# Altium schematic sheet Power.SchDoc: QUTMS Shutdown V2 - Power
size A4; Author: Jonn Dillon; Organization: QUT Motorsport; Address1: O-120; Address2: O Block; Address3: QUT Gardens Point; Address4: Brisbane, 4000; DocumentNumber: 9; SheetNumber: 9; SheetTotal: 10
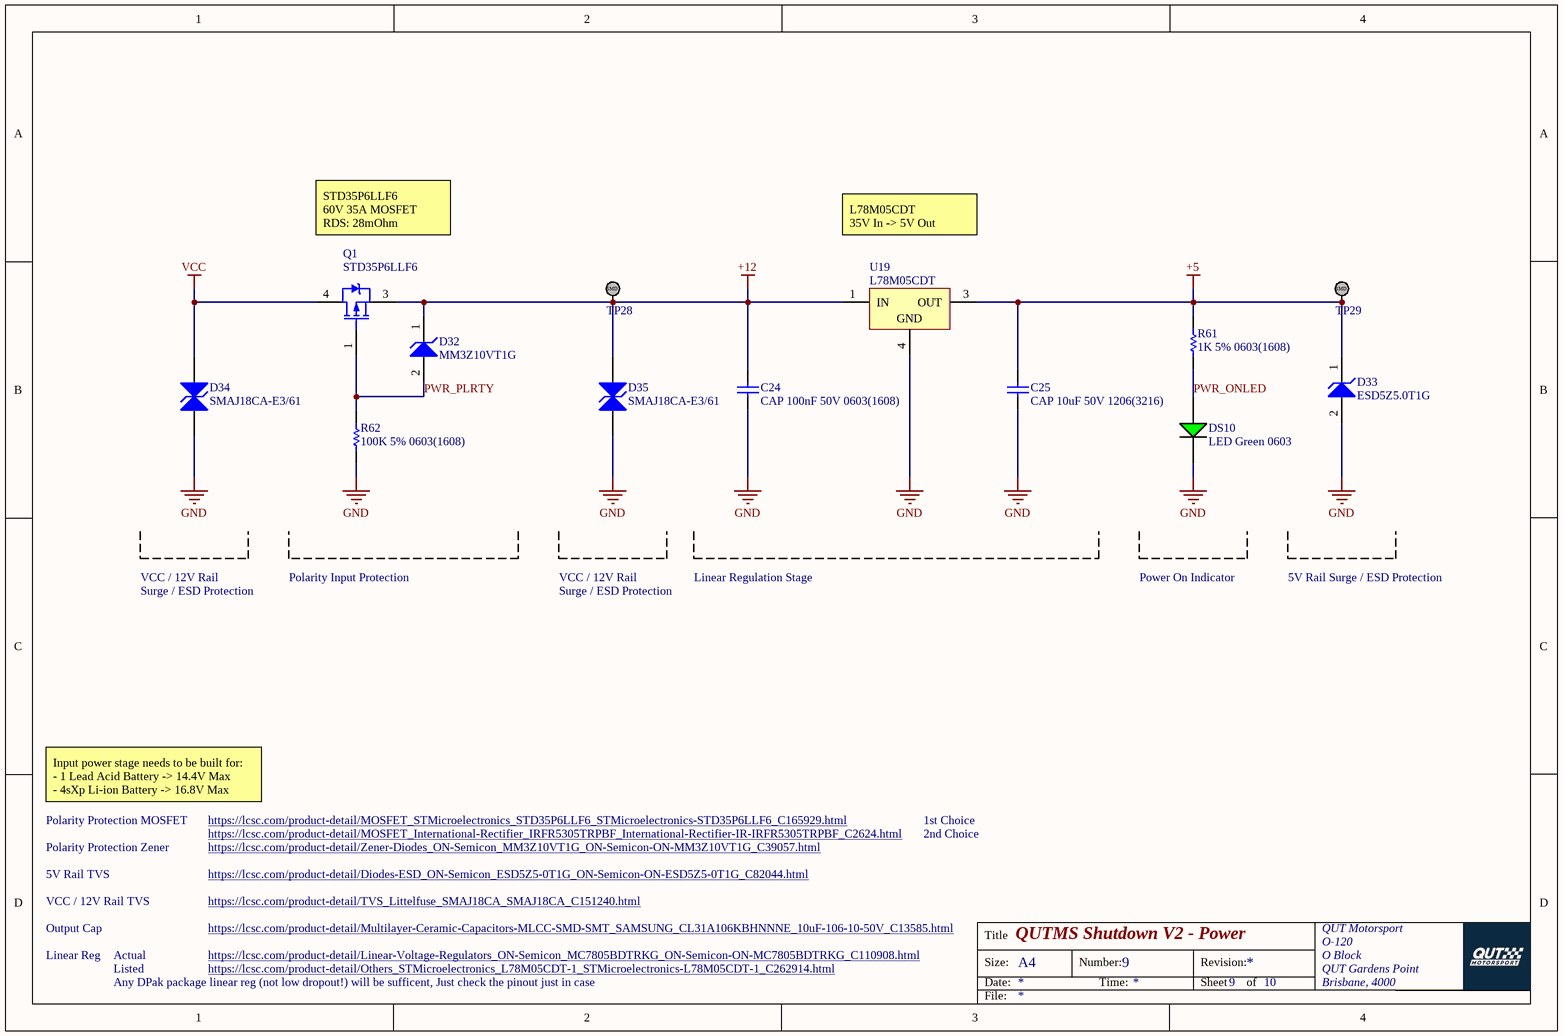
[diagram p0: Power.SchDoc]

## Parts
C24  CAP 100nF 50V 0603(1608)  [CAPC0603(1608)100_N]
C25  CAP 10uF 50V 1206(3216)  [CAPC1206(3216)190_N]
D32  MM3Z10VT1G  [ONSC-SOD-323-2-477-02_V]
D33  ESD5Z5.0T1G  [ONSC-SOD-523-2-502-01_V]
D34  SMAJ18CA-E3/61  [VISH-DO-214AC-2_N]
D35  SMAJ18CA-E3/61  [VISH-DO-214AC-2_N]
DS10  LED Green 0603  [LED GREEN 0603]
Q1  STD35P6LLF6  [ONSC-DPAK-3-369C-01_V]
R61  1K 5% 0603(1608)  [RESC0603(1608)_N]
R62  100K 5% 0603(1608)  [RESC0603(1608)_N]
TP28  TestPoint_SMD  [TestPointSMD]  (value not drawn)
TP29  TestPoint_SMD  [TestPointSMD]  (value not drawn)
U19  L78M05CDT  [STM-TO252-3_A_V]

## Nets
+5: C25.2 D33.1(K) R61.2 TP29.1 U19.3(OUT)
+12: C24.2 D32.1(K) D35.2(A2) Q1.3(S) TP28.1 U19.1(IN)
GND: C24.1 C25.1 D33.2(A) D34.1(A1) D35.1(A1) DS10.2(C) R62.1 U19.4(GND)
VCC: D34.2(A2) Q1.4(D)
PWR_ONLED: DS10.1(A) R61.1
PWR_PLRTY: D32.2(A) Q1.1(G) R62.2

## Notes on the sheet
- STD35P6LLF6
  60V 35A MOSFET
  RDS: 28mOhm
- L78M05CDT
  35V In -> 5V Out
- VCC / 12V Rail
- Polarity Input Protection
- Linear Regulation Stage
- Power On Indicator
- 5V Rail Surge / ESD Protection
- Surge / ESD Protection
- Polarity Protection MOSFET
- Polarity Protection Zener
- Input power stage needs to be built for:
  - 1 Lead Acid Battery -> 14.4V Max
  - 4sXp Li-ion Battery -> 16.8V Max
- https://lcsc.com/product-detail/MOSFET_International-Rectifier_IRFR5305TRPBF_International-Rectifier-IR-IRFR5305TRPBF_C2624.html
- https://lcsc.com/product-detail/Zener-Diodes_ON-Semicon_MM3Z10VT1G_ON-Semicon-ON-MM3Z10VT1G_C39057.html
- https://lcsc.com/product-detail/MOSFET_STMicroelectronics_STD35P6LLF6_STMicroelectronics-STD35P6LLF6_C165929.html
- 1st Choice
- 2nd Choice
- 5V Rail TVS
- VCC / 12V Rail TVS
- https://lcsc.com/product-detail/Diodes-ESD_ON-Semicon_ESD5Z5-0T1G_ON-Semicon-ON-ESD5Z5-0T1G_C82044.html
- https://lcsc.com/product-detail/TVS_Littelfuse_SMAJ18CA_SMAJ18CA_C151240.html
- Linear Reg
- Output Cap
- Actual
- Listed
- Any DPak package linear reg (not low dropout!) will be sufficent, Just check the pinout just in case
- https://lcsc.com/product-detail/Multilayer-Ceramic-Capacitors-MLCC-SMD-SMT_SAMSUNG_CL31A106KBHNNNE_10uF-106-10-50V_C13585.html
- https://lcsc.com/product-detail/Linear-Voltage-Regulators_ON-Semicon_MC7805BDTRKG_ON-Semicon-ON-MC7805BDTRKG_C110908.html
- https://lcsc.com/product-detail/Others_STMicroelectronics_L78M05CDT-1_STMicroelectronics-L78M05CDT-1_C262914.html
- Title
- Size:
- Date:
- A4
- Number:
- Time:
- Revision:
- Sheet
- of
- File:
- (in symbol TestPoint_SMD) SMD

## Library data of the parts
C24 = CMP-1035-02591-1: CAP 100nF 50V ±5% 0603 (1608 Metric) Thickness 1mm SMD; Tolerance: Â±5%; Case-Metric: 1608; Case-EIA: 0603; Rated Voltage: 50 V; Max Thickness: 1 mm; Technology: SMT; Value: 100nF
C25 = CMP-1037-04982-1: CAP 10uF 50V ±10% 1206 (3216 Metric) Thickness 1.9mm SMD; Case-EIA: 1206; Tolerance: Â±10%; Case-Metric: 3216; Technology: SMT; Max Thickness: 1.9 mm; Value: 10uF; Rated Voltage: 50 V
D32 = CMP-1060-00715-1: Zener Voltage Regulator, 300 mW, 2-Pin SOD-323, Pb-Free, Tape and Reel; Manufacturer: On Semiconductor; VZ Typ (V): 10; P Max (W): 0.3; ComponentLink1Description: Manufacturer URL; DatasheetVersion: Rev. 9; PartNumber: MM3Z10VT1G; PackageDescription: 2-Pin SOD, Body 1.7 x 1.25 mm; Packing: Tape and Reel; ComponentLink1URL: http://www.onsemi.com/; PackageReference: SOD-323-2-477-02; PackageVersion: Rev. H, 03/2007; ComponentLink3URL: http://www.onsemi.com/pub_link/Collateral/477-02.PDF.1; Mounting Technology: Surface Mount; RoHS: Pb-Free; ComponentLink2URL: http://www.onsemi.cn/pub_link/Collateral/MM3Z2V4T1-D.PDF; ComponentLink3Description: Package Specification; ComponentLink2Description: Datasheet
D33 = CMP-1063-00102-1: Transient Voltage Suppressor, Micro-Packaged Diode for ESD Protection, 2-Pin SOD-523, Pb-Free, Tape and Reel; Manufacturer: On Semiconductor; V(BR) Min (V): 6.2; VRWM Max (V): 5; Number of Lines: 1; PPK Max (W): 174; IR Max (uA): 0.05; Direction: Unidirectional; PackageVersion: Rev. E, 09/2010; Mounting Technology: Surface Mount; Packing: Tape and Reel; ComponentLink2URL: http://www.onsemi.cn/pub_link/Collateral/ESD5Z2.5T1-D.PDF; ComponentLink2Description: Datasheet; PackageReference: SOD-523-2-502-01; ComponentLink1Description: Manufacturer URL; ComponentLink3URL: http://www.onsemi.com/pub_link/Collateral/502-01.PDF; PackageDescription: 2-Pin SOD, Body 1.2 x 0.8 mm; ComponentLink3Description: Package Specification; ComponentLink1URL: http://www.onsemi.com/; RoHS: Pb-Free; PartNumber: ESD5Z5.0T1G; DatasheetVersion: Rev. 10
D34 D35 = CMP-0548-00180-2: Transient Voltage Suppressor, 6.40 to 231 V, 18 V Stand-off Voltage, Bi-Directional, -55 to 155 degC, 2-pin DO-214AC, Pb-Free, Tape and Reel; Manufacturer: Vishay Semiconductor; VWM (V): 18; IFSM: 40 A; VBR Bi-Directional (V): 6.4 to 231; ID (uA): 2; PPPM (W): 400, 300; PackageDescription: 2-Pin DO-214AC (SMA), Body 4.245 x 2.665 mm; ComponentLink1Description: Manufacturer URL; RoHS: TRUE; ComponentLink3Description: Package Specification; ComponentLink3URL: http://www.vishay.com/docs/88390/smaj50a.pdf; Mounting Technology: Surface Mount; DatasheetVersion: 12/8/2013; ComponentLink1URL: http://www.vishay.com/; ComponentLink2URL: http://www.vishay.com/docs/88390/smaj50a.pdf; PackageReference: DO-214AC-2; ComponentLink2Description: Datasheet; PartNumber: SMAJ18CA-E3/61; Packing: Tape and Reel; Operating Junction and Storage Temperature Range: -55 to 150 degC
Q1 = CMP-1058-00390-1: Power MOSFET, -60 V, -12 A, P-Channel, 3-Pin DPAK, Pb-Free, Tape and Reel; Manufacturer: On Semiconductor; PartNumber: NTD2955T4G; V(BR)DSS Min (V): 60; Qrr Typ (nC): 100; Coss Typ (pF): 150; Crss Typ (pF): 50; PD Max (W): 55; ID Max (A): 12; Channel Polarity: P Channel; Configuration: Single; VGS Max (V): 20; VGS(th) Max (V): 4; Ciss Typ (pF): 500; ComponentLink1URL: http://www.onsemi.com/; DatasheetVersion: Rev. 13; Packing: Tape and Reel; PackageVersion: Rev. E, 02/2014; Mounting Technology: Surface Mount; ComponentLink3Description: Package Specification; Package Type: DPAK-3, IPAK-4; ComponentLink3URL: http://www.onsemi.cn/pub_link/Collateral/369C.PDF; RoHS: Pb-Free; ComponentLink2URL: http://www.onsemi.cn/pub_link/Collateral/NTD2955-D.PDF; ComponentLink2Description: Datasheet; PackageReference: DPAK-3-369C-01; PackageDescription: 3-Pin Flange Mount, Body 6.54 x 6.095 mm, Pitch 2.29 mm; ComponentLink1Description: Manufacturer URL
R61 = CMP-1012-00074-1: 1K 0.1W 5% 0603 (1608 Metric)  SMD; Case-EIA: 0603; Case-Metric: 1608; Value: 1000.00 Ohm; Technology: SMT; Tolerance: 5 %; Power: 0.1 W
R62 = CMP-1012-00122-1: 100K 0.1W 5% 0603 (1608 Metric)  SMD; Case-EIA: 0603; Value: 100000.00 Ohm; Case-Metric: 1608; Tolerance: 5 %; Power: 0.1 W; Technology: SMT
U19 = CMP-2000-06530-1: Precision Regulator, 0.5 A, 5 V Output, 0 to 150 degC, 3-Pin DPAK (TO252), RoHS, Tube; Manufacturer: STMicroelectronics; No. of Pins: 3Pins; SVHC: NoSVHC(17-Dec-2015); Input Voltage Max: 35V; Linear Regulator Case Style: TO-252; Output Voltage Nom.: 5V; Output Current: 500mA; Input Voltage Min: 10V; Manufacturer URL: http://www.st.com/; Operating Temperature Min: 0°C; Package Description: 3-Pin Transistor Outline, Body 6.5 x 6.1 mm, Pitch 2.28 mm; Package Reference: TO252; Datasheet Version: Rev. 20, 06/2014; Packaging: Each; Mounting Technology: SurfaceMount; Operating Temperature Max: 150°C; Datasheet URL: http://www.st.com/content/ccc/resource/technical/document/datasheet/d7/5f/dc/5c/d5/b6/48/7c/CD00000447.pdf/files/CD00000447.pdf/jcr:content/translations/en.CD00000447.pdf